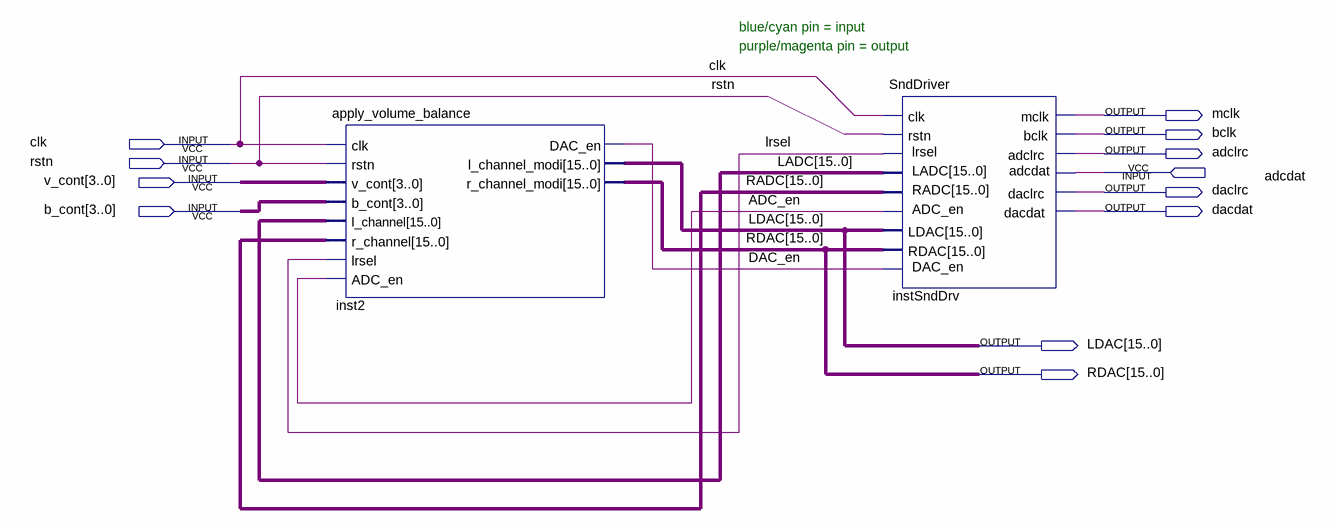
[diagram p0: schematic sheet]
// Quartus schematic Sound.bdf as structural Verilog: 2 symbols, 12 pins
module Sound (
  input  clk,
  input  rstn,
  input  adcdat,
  input  [3:0] v_cont,
  input  [3:0] b_cont,
  output mclk,
  output bclk,
  output adclrc,
  output daclrc,
  output dacdat,
  output [15:0] LDAC,
  output [15:0] RDAC
);

  wire ADC_en, DAC_en, lrsel;
  wire [15:0] LADC, RADC;

  apply_volume_balance inst2 (
    .clk(clk), .rstn(rstn), .v_cont(v_cont), .b_cont(b_cont), .l_channel(LADC), .r_channel(RADC),
    .lrsel(lrsel), .ADC_en(ADC_en), .DAC_en(DAC_en), .l_channel_modi(LDAC), .r_channel_modi(RDAC));
  SndDriver instSndDrv (
    .clk(clk), .rstn(rstn), .LDAC(LDAC), .adcdat(adcdat), .RDAC(RDAC), .DAC_en(DAC_en), .mclk(mclk),
    .bclk(bclk), .adclrc(adclrc), .daclrc(daclrc), .lrsel(lrsel), .LADC(LADC), .dacdat(dacdat), .RADC(RADC),
    .ADC_en(ADC_en));

  // Notes on the sheet:
  //   blue/cyan pin = input
  //   purple/magenta pin = output
endmodule
